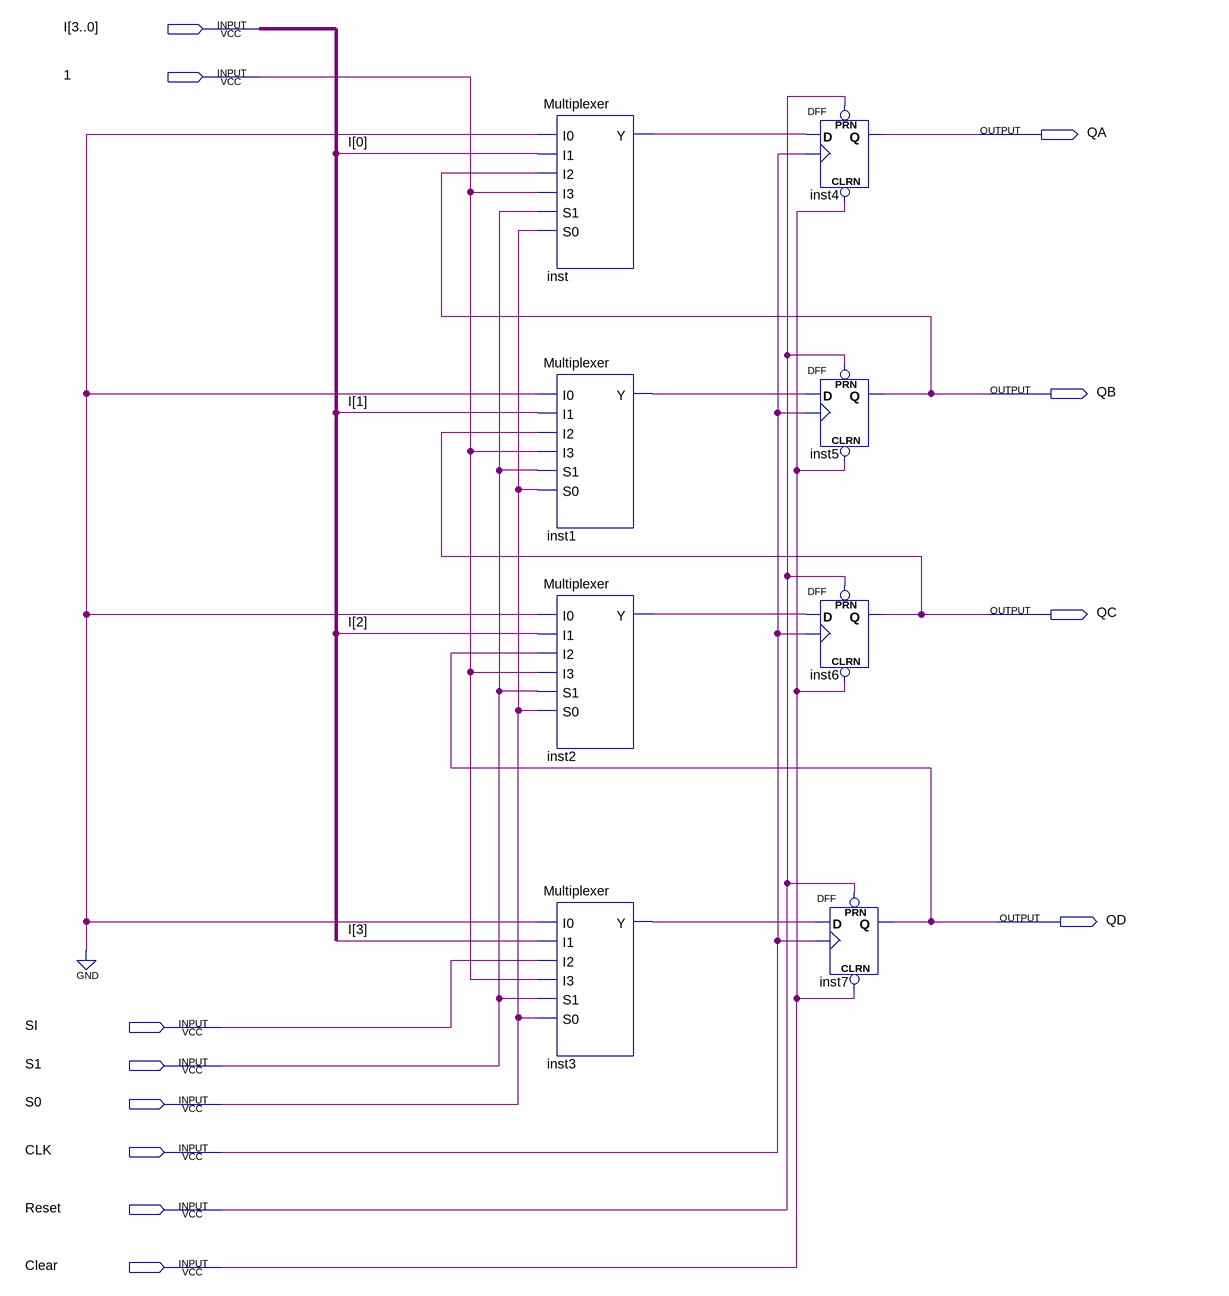
[diagram p0: schematic sheet]
// Quartus schematic Register.bdf as structural Verilog: 8 symbols, 12 pins
module Register (
  input  [3:0] I,
  input  \1 ,
  input  SI,
  input  S1,
  input  S0,
  input  CLK,
  input  Reset,
  input  Clear,
  output QA,
  output QB,
  output QC,
  output QD
);

  wire inst1_y, inst2_y, inst3_y, inst_y;

  Multiplexer inst (.I0(1'b0), .I1(I[0]), .I2(QB), .I3(\1 ), .S1(S1), .S0(S0), .Y(inst_y));
  Multiplexer inst1 (.I0(1'b0), .I1(I[1]), .I2(QC), .I3(\1 ), .S1(S1), .S0(S0), .Y(inst1_y));
  Multiplexer inst2 (.I0(1'b0), .I1(I[2]), .I2(QD), .I3(\1 ), .S1(S1), .S0(S0), .Y(inst2_y));
  Multiplexer inst3 (.I0(1'b0), .I1(I[3]), .I2(SI), .I3(\1 ), .S1(S1), .S0(S0), .Y(inst3_y));
  DFF inst4 (.CLRN(Clear), .CLK(CLK), .D(inst_y), .PRN(Reset), .Q(QA));
  DFF inst5 (.CLRN(Clear), .CLK(CLK), .D(inst1_y), .PRN(Reset), .Q(QB));
  DFF inst6 (.CLRN(Clear), .CLK(CLK), .D(inst2_y), .PRN(Reset), .Q(QC));
  DFF inst7 (.CLRN(Clear), .CLK(CLK), .D(inst3_y), .PRN(Reset), .Q(QD));
endmodule
